# Altium project embs pcb card.PrjPcb
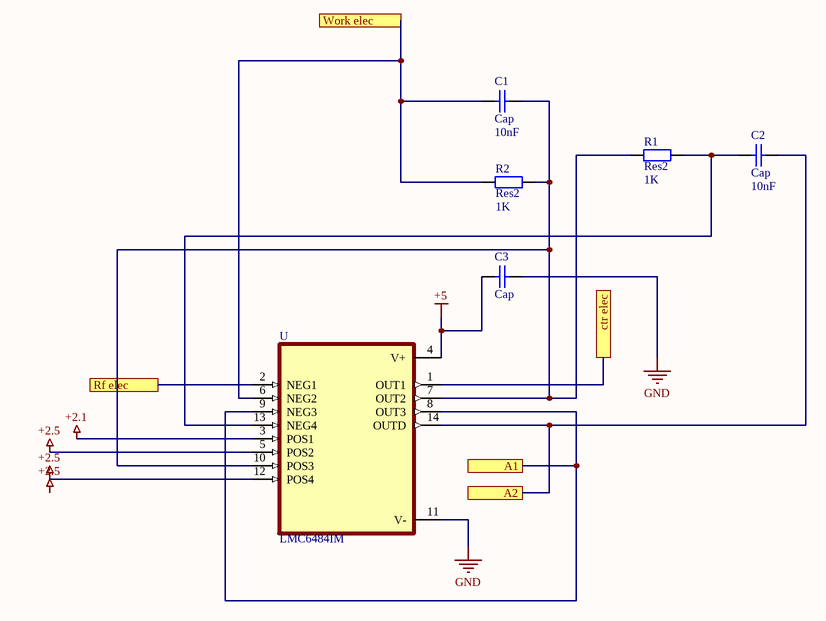
[diagram p0: Sheet1.SchDoc]
1 sheet, 6 parts. Net scope: flat (ports and power ports of the same name join across sheets).
Board file: PCB1.PcbDoc

## Sheet Sheet1.SchDoc
size A

### Parts
C1  Cap  value 10nF  [RAD-0.3]
C2  Cap  value 10nF  [RAD-0.3]
C3  Cap  [RAD-0.3]
R1  Res2  value 1K  [AXIAL-0.4]
R2  Res2  value 1K  [AXIAL-0.4]
U  LMC6484IM  [SOIC127P600X175-14N]

### Ports
 A1, A2, ctr elec, Rf elec, Work elec

### Nets
+2.1: U.3(POS1)
+2.5: U.5(POS2) U.12(POS4)
+5: C3.1 U.4(V+)
GND: C3.2 U.11(V-)
NetC1_1: C1.1 R2.1 U.6(NEG2) ; port Work elec
NetC1_2: C1.2 R1.1 R2.2 U.7(OUT2) U.10(POS3)
NetC2_1: C2.1 R1.2 U.13(NEG4)
NetC2_2: C2.2 U.14(OUTD) ; port A2
NetU_1: U.1(OUT1) ; port ctr elec
NetU_2: U.2(NEG1) ; port Rf elec
NetU_8: U.8(OUT3) U.9(NEG3) ; port  A1

### Notes on the sheet
- Labels drawn without touching a wire or pin: +2.5

### Library data of the parts
C1 C2 = Cap: Capacitor; Published: 8-Jun-2000; LatestRevisionDate: 17-Jul-2002; LatestRevisionNote: Re-released for DXP Platform.; PackageReference: RAD-0.3; Publisher: Altium Limited; PackageDescription: Radial Cap, Thru-Hole; 2 Leads; 0.3 in Pin Spacing
C3 = Cap: Capacitor; Value: 100pF; Published: 8-Jun-2000; LatestRevisionDate: 17-Jul-2002; LatestRevisionNote: Re-released for DXP Platform.; PackageReference: RAD-0.3; Publisher: Altium Limited; PackageDescription: Radial Cap, Thru-Hole; 2 Leads; 0.3 in Pin Spacing
R1 R2 = Res2: Resistor; Published: 8-Jun-2000; LatestRevisionDate: 17-Jul-2002; LatestRevisionNote: Re-released for DXP Platform.; PackageReference: AXIAL-0.4; Publisher: Altium Limited; PackageDescription: Axial Device, Thru-Hole; 2 Leads; 0.4 in Pin Spacing
U = LMC6484IM: Ultra-low Bias Current, Precision CMOS Rail-to-Rail Input and Output Quad Operational Amplifier 14-SOIC -40 to 85; MF: Texas Instruments; MP: LMC6484IM/NOPB; Price: None; Value: *; SnapEDA_Link: https://www.snapeda.com/parts/LMC6484IM/NOPB/Texas%20Instruments/view-part/18392/?ref=snap; Package: SOIC-14 Texas Instruments; Mouser-Purchase-URL: https://snapeda.com/shop?store=Mouser&id=18392; Arrow_Electronics-Purchase-URL: https://snapeda.com/shop?store=Arrow+Electronics&id=18392; Availability: Good; DigiKey-Purchase-URL: https://snapeda.com/shop?store=DigiKey&id=18392